# Altium schematic sheet 4_MICROCONTROLADOR.SchDoc
size Tabloid; SheetNumber: 4; SheetTotal: 5; SPICEModelCacheCXJGCLTJ: <root> / <DocumentId>CXJGCLTJ</DocumentId> / <CacheFrame Number="0"> / <Model Name="0805_885012207053_4.7uf" Kind="CKT"> / <Text>******* / .subckt 0805_885012207053_4.7uF 1 2 / Rser 1 3 0.0105 / Lser 2 4 0.0000000007 / C1 3 4 0.0000047 / Rpar 3 4 10000000 / .ends 0805_885012207053_4.7uF</Text> / </Model> / <Model Name="0603_885012206046_100nf" Kind="CKT"> / <Text>******* / .subckt 0603_885012206046_100nF 1 2 / Rser 1 3 0.0189313024822 / Lser 2 4 4.50736859E-10 / C1 3 4 0.0000001 / Rpar 3 4 5000000000 / .ends 0603_885012206046_100nF</Text> / </Model> / <Model Name="0805_885012207026_10uf" Kind="CKT"> / <Text>******* / .subckt 0805_885012207026_10uF 1 2 / Rser 1 3 0.00369416302331 / Lser 2 4 5.01488494E-10 / C1 3 4 0.00001 / Rpar 3 4 5000000 / .ends 0805_885012207026_10uF</Text> / </Model> / <Model Name="0603_74279266_1000ohm" Kind="CKT"> / <Text>******* / .subckt 0603_74279266_1000ohm 1 2 / Rp 1 2 1290 / Cp 1 2 0.604p / Rs 1 N3 0.6 / L1 N3 2 2.393u / .ends 0603_74279266_1000ohm</Text> / </Model> / <Model Name="0603_150060vs75000" Kind="CKT"> / <Text>****** / .subckt 0603_150060VS75000  1  2 / D1 1 2 SMCW / .MODEL SMCW D / + IS=10.010E-21 / + N=1.9077 / + RS=1.0000E-6 / + IKF=32.936E-3 / + CJO=1.0000E-12 / + M=.3333 / + VJ=.75 / + BV=5 / + IBV=10.00E-6 / + TT=5.0000E-9 / .ends</Text> / </Model> / <Model Name="0603_885012106004_2.2uf" Kind="CKT"> / <Text>******* / .subckt 0603_885012106004_2.2uF 1 2 / Rser 1 3 0.00652337052819 / Lser 2 4 4.58001637E-10 / C1 3 4 0.0000022 / Rpar 3 4 50000000 / .ends 0603_885012106004_2.2uF</Text> / </Model> / </CacheFrame> / </root>
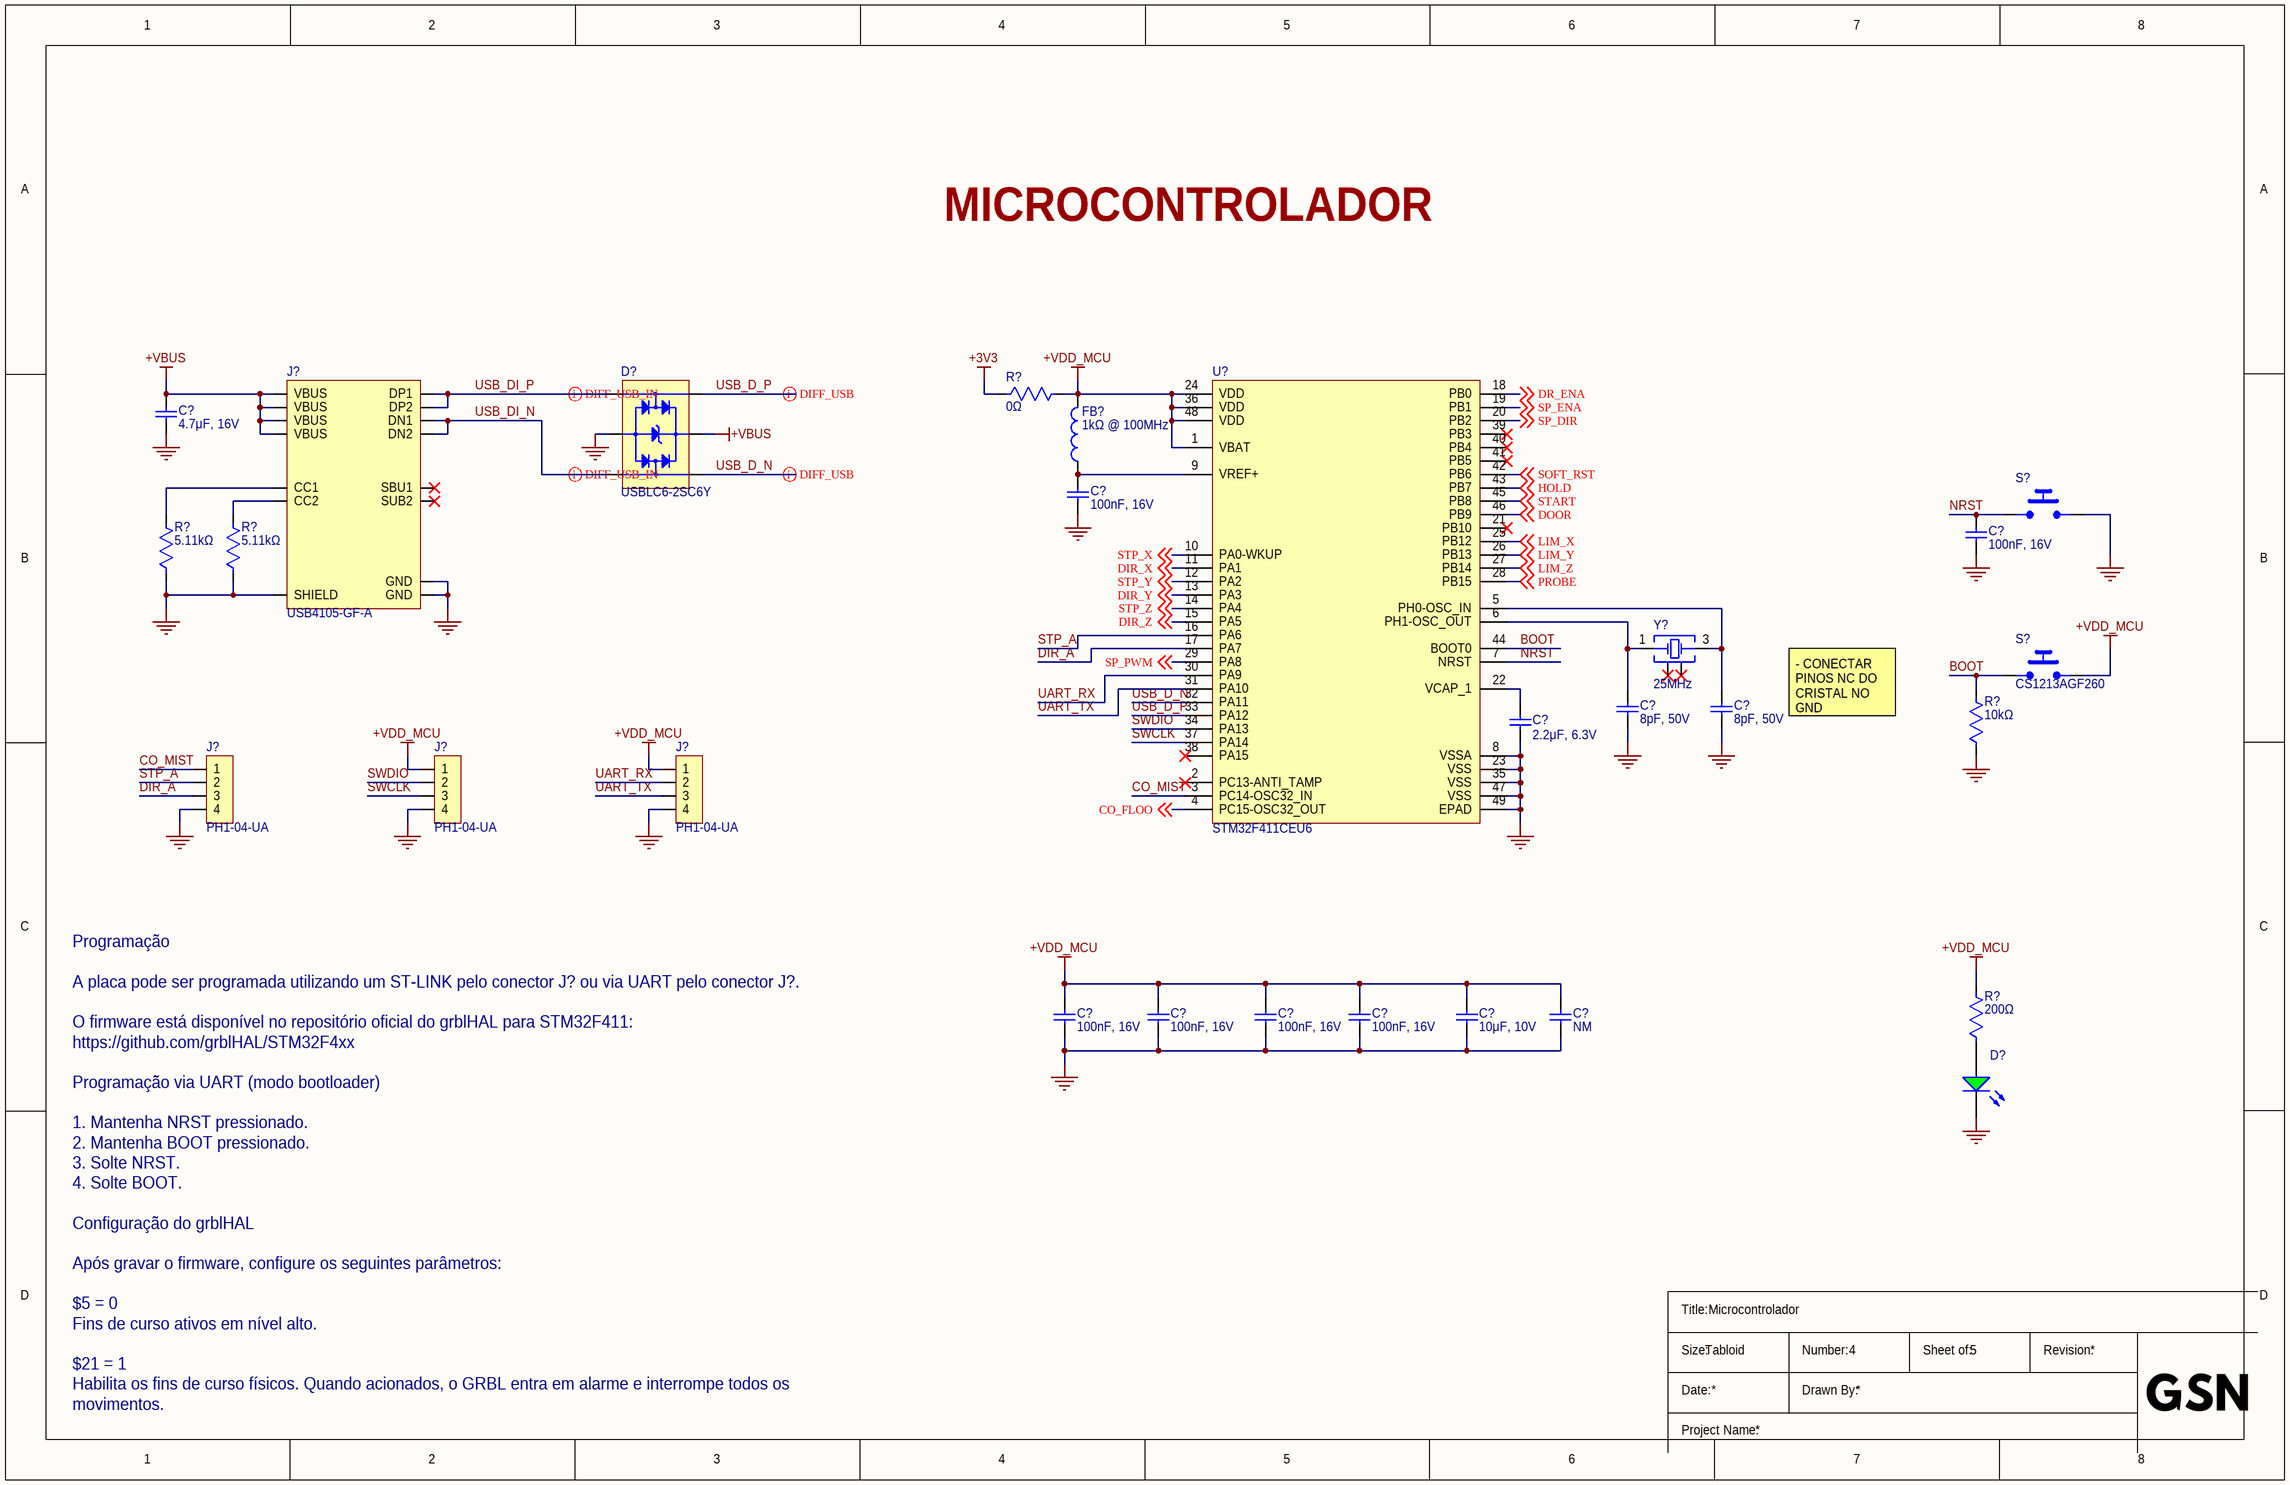
[diagram p0: 4_MICROCONTROLADOR.SchDoc]

## Parts
(Parts that share a designator on the sheet are numbered #1, #2 ... from top to bottom, then left to right.)
C?#1  4.7μF, 16V  [WCAP-CSGP_0805_L2W1.25H1.25]
C?#2  100nF, 16V  [WCAP-CSGP_0603_L1.6W0.8H0.8_Reflow]
C?#3  100nF, 16V  [WCAP-CSGP_0603_L1.6W0.8H0.8_Reflow]
C?#4  8pF, 50V  [CAP-CER-0603]
C?#5  8pF, 50V  [CAP-CER-0603]
C?#6  2.2μF, 6.3V  [WCAP-CSGP_0603_L1.6W0.8H0.8_Reflow]
C?#7  100nF, 16V  [WCAP-CSGP_0603_L1.6W0.8H0.8_Reflow]
C?#8  100nF, 16V  [WCAP-CSGP_0603_L1.6W0.8H0.8_Reflow]
C?#9  100nF, 16V  [WCAP-CSGP_0603_L1.6W0.8H0.8_Reflow]
C?#10  100nF, 16V  [WCAP-CSGP_0603_L1.6W0.8H0.8_Reflow]
C?#11  10μF, 10V  [WCAP-CSGP_0805_L2W1.25H1.25]
C?#12  NM  [WCAP-CSGP_0805_L2W1.25H1.25]
D?#1  USBLC6-2SC6Y  [SOT-23-6]
D?#2  Bright Green, 2V, 140°  [WL-SMCW_0603_150060xx75000]  (value not drawn)
FB?  1kΩ @ 100MHz  [WE-CBF_0603_L1.6W0.8H0.8_HS_WB]
J?#1  USB4105-GF-A  [USB4105-GF-A]
J?#2  PH1-04-UA  [CON_HDR_MAL_VERT_4P_2P54_PITCH]
J?#3  PH1-04-UA  [CON_HDR_MAL_VERT_4P_2P54_PITCH]
J?#4  PH1-04-UA  [CON_HDR_MAL_VERT_4P_2P54_PITCH]
R?#1  0Ω  [0805-REFLOW]
R?#2  5.11kΩ  [0603-REFLOW]
R?#3  5.11kΩ  [0603-REFLOW]
R?#4  10kΩ  [0603-REFLOW]
R?#5  200Ω  [0603-REFLOW]
S?#1  CS1213AGF260  [TACTILE_SWITCH_SMD_3P9MM_2P9MM]  (value not drawn)
S?#2  CS1213AGF260  [TACTILE_SWITCH_SMD_3P9MM_2P9MM]
U?  STM32F411CEU6  [UFQFN-48-7X7_EXPOSED_PAD]
Y?  25MHz  [WE-XTAL_CFPX-180]

## Nets
+3V3: R?#1.1
+VBUS: C?#1.2 D?#1.5(VBUS) J?#1.A4(VBUS) J?#1.A9(VBUS) J?#1.B4(VBUS) J?#1.B9(VBUS)
+VDD_MCU: C?#7.2 C?#8.2 C?#9.2 C?#10.2 C?#11.2 C?#12.2 FB?.2 J?#3.1 J?#4.1 R?#1.2 R?#5.2 S?#2.2 U?.1(VBAT) U?.24(VDD) U?.36(VDD) U?.48(VDD)
GND: C?#1.1 C?#2.1 C?#3.1 C?#4.1 C?#5.1 C?#6.1 C?#7.1 C?#8.1 C?#9.1 C?#10.1 C?#11.1 C?#12.1 D?#1.2(GND) D?#2.1(K) J?#1.A1_B12(GND) J?#1.B1_A12(GND) J?#1.SH(SHIELD) J?#2.4 J?#3.4 J?#4.4 R?#2.1 R?#3.1 R?#4.1 S?#1.2 U?.8(VSSA) U?.23(VSS) U?.35(VSS) U?.47(VSS) U?.49(EPAD)
BOOT: R?#4.2 S?#2.1 U?.44(BOOT0)
CO_FLOO: U?.4(PC15-OSC32_OUT) ; off-sheet CO_FLOO
CO_MIST: J?#2.1 U?.3(PC14-OSC32_IN)
DIR_A: J?#2.3 U?.17(PA7)
DIR_X: U?.11(PA1) ; off-sheet DIR_X
DIR_Y: U?.13(PA3) ; off-sheet DIR_Y
DIR_Z: U?.15(PA5) ; off-sheet DIR_Z
DOOR: U?.46(PB9) ; off-sheet DOOR
DR_ENA: U?.18(PB0) ; off-sheet DR_ENA
HOLD: U?.43(PB7) ; off-sheet HOLD
LIM_X: U?.25(PB12) ; off-sheet LIM_X
LIM_Y: U?.26(PB13) ; off-sheet LIM_Y
LIM_Z: U?.27(PB14) ; off-sheet LIM_Z
NRST: C?#3.2 S?#1.1 U?.7(NRST)
PROBE: U?.28(PB15) ; off-sheet PROBE
SOFT_RST: U?.42(PB6) ; off-sheet SOFT_RST
SP_DIR: U?.20(PB2) ; off-sheet SP_DIR
SP_ENA: U?.19(PB1) ; off-sheet SP_ENA
SP_PWM: U?.29(PA8) ; off-sheet SP_PWM
START: U?.45(PB8) ; off-sheet START
STP_A: J?#2.2 U?.16(PA6)
STP_X: U?.10(PA0-WKUP) ; off-sheet STP_X
STP_Y: U?.12(PA2) ; off-sheet STP_Y
STP_Z: U?.14(PA4) ; off-sheet STP_Z
SWCLK: J?#3.3 U?.37(PA14)
SWDIO: J?#3.2 U?.34(PA13)
UART_RX: J?#4.2 U?.30(PA9)
UART_TX: J?#4.3 U?.31(PA10)
USB_D_N: D?#1.4(IO2) U?.32(PA11)
USB_D_P: D?#1.6(IO1) U?.33(PA12)
USB_DI_N: D?#1.3(IO2) J?#1.A7(DN1) J?#1.B7(DN2)
USB_DI_P: D?#1.1(IO1) J?#1.A6(DP1) J?#1.B6(DP2)
NetC?#2_2: C?#2.2 FB?.1 U?.9(VREF+)
NetC?#4_2: C?#4.2 U?.6(PH1-OSC_OUT) Y?.1(Crystal)
NetC?#5_2: C?#5.2 U?.5(PH0-OSC_IN) Y?.3(Crystal)
NetC?#6_2: C?#6.2 U?.22(VCAP_1)
NetD?#2_2: D?#2.2(A) R?#5.1
NetJ?#1_A5: J?#1.A5(CC1) R?#2.2
NetJ?#1_B5: J?#1.B5(CC2) R?#3.2

Not connected (* = marked no-connect by the designer): J?#1 A8(SBU1)* B8(SUB2)*; U? 2(PC13-ANTI_TAMP)* 21(PB10)* 38(PA15)* 39(PB3)* 40(PB4)* 41(PB5)*; Y? 2(GND&Lid)* 4(GND&Lid)*

## Layout directives
differential pair; differential pair class USB: USB_D_N, USB_D_P, USB_DI_N, USB_DI_P

## Notes on the sheet
- MICROCONTROLADOR
- - CONECTAR PINOS NC DO CRISTAL NO GND
- Microcontrolador
- Programação
  A placa pode ser programada utilizando um ST-LINK pelo conector J? ou via UART pelo conector J?.
  O firmware está disponível no repositório oficial do grblHAL para STM32F411:
  https://github.com/grblHAL/STM32F4xx
  Programação via UART (modo bootloader)
  1. Mantenha NRST pressionado.
  2. Mantenha BOOT pressionado.
  3. Solte NRST.
  4. Solte BOOT.
  Configuração do grblHAL
  Após gravar o firmware, configure os seguintes parâmetros:
  $5 = 0
  Fins de curso ativos em nível alto.
  $21 = 1
  Habilita os fins de curso físicos. Quando acionados, o GRBL entra em alarme e interrompe todos os movimentos.
  $6 = 0
  Define o probe como ativo em nível alto.
- Title:
- Size:
- Tabloid
- Number:
- Sheet of:
- Revision:
- Date:
- Project Name:
- Drawn By:

## Library data of the parts
C?#1 = 885012207053: WCAP-CSGP Multilayer Ceramic Chip Capacitor, General Purpose, size 0805, 4.7μF, 16V; Manufacturer: Wurth Elektronik; Case/Size Code: 0805; Capacitance Tolerance: +/-10%; Ceramic Type: X7R; Dissipation Factor: 10%; Insulation Resistance: 0.02GΩ; Technical Reference: X7R0805475K016DFCT10000; Manufacturer Part Number: 885012207053; Category: Multilayer Ceramic Chip Capacitors; Match Code: WCAP-CSGP; ComponentLink1Description: Website Link; ComponentLink1URL: https://www.we-online.com/redexpert/article/885012207053?ad; ComponentLink2Description: Datasheet Link; ComponentLink2URL: https://www.we-online.com/redexpert/spec/885012207053?ad; Mount: Surface Mount; Min Operating Temperature: -55°C; Max Operating Temperature: 125°C; Packaging: Tape and Reel; Length: 2mm; Width: 1.25mm; Height: 1.25mm; Capacitance: 4.7μF; Rated Voltage (DC): 16V
C?#2 C?#3 C?#7-C?#10 = 885012206046: WCAP-CSGP Multilayer Ceramic Chip Capacitor, General Purpose, size 0603, 100nF, 16V; Manufacturer: Wurth Elektronik; Case/Size Code: 0603; Capacitance Tolerance: +/-10%; Ceramic Type: X7R; Dissipation Factor: 3.5%; Insulation Resistance: 5GΩ; Technical Reference: X7R0603104K016DFCT10000; Manufacturer Part Number: 885012206046; Category: Multilayer Ceramic Chip Capacitors; Match Code: WCAP-CSGP; ComponentLink1Description: Website Link; ComponentLink1URL: https://www.we-online.com/redexpert/article/885012206046?ad; ComponentLink2Description: Datasheet Link; ComponentLink2URL: https://www.we-online.com/redexpert/spec/885012206046?ad; Mount: Surface Mount; Min Operating Temperature: -55°C; Max Operating Temperature: 125°C; Packaging: Tape and Reel; Length: 1.6mm; Width: 0.8mm; Height: 0.8mm; Capacitance: 100nF; Rated Voltage (DC): 16V
C?#4 C?#5 = CC0603DRNPO9BN8R0: CAP CER 8PF 50V C0G/NPO 0603; Manufacturer: Yageo Group; Dielectric: C0G; Dielectric Material: Ceramic; Supplier: DigiKey; Supplier Part Number: 311-1057-1-ND; Manufacturer Part Number: CC0603DRNPO9BN8R0; RoHS: Compliant; Category: Ceramic Capacitors; Stock: 41634; Pricing: 1=0.1, 10=0.042, 50=0.0286, 100=0.0246, 500=0.01776, 1000=0.01568 (USD); Value: 8pF; Case/Package: 0603; Case Code (Imperial): 0603; Case Code (Metric): 1608; China RoHS: Compliant; Composition: Ceramic; Depth: 800µm; Halogen Free: Halogen Free; Height: 800µm; Lead Free: Lead Free; Length: 1.6mm; Lifecycle Status: Production; Max Operating Temperature: 125°C; Min Operating Temperature: -55°C; Mounting Technology: Surface Mount; Number of Terminals: 2; Packaging: Digi-Reel®; REACH SVHC: Yes; Schedule B: 8532240020, 8532240020|8532240020, 8532240020|8532240020|8532240020, 8532240020|8532240020|8532240020|8532240020; Termination: SMD/SMT; Thickness: 889µm; Voltage Rating: 50V; Voltage Rating (DC): 50V; Width: 800µm; ComponentLink1URL: https://datasheet.octopart.com:443/CC0603DRNPO9BN8R0-Yageo-datasheet-78855684.pdf?src-supplier=IHS; ComponentLink1Description: https://datasheet.octopart.com:443/CC0603DRNPO9BN8R0-Yageo-datasheet-78855684.pdf?src-supplier=IHS; ComponentLink2URL: https://datasheet.octopart.com:443/CC0603DRNPO9BN8R0-Yageo-datasheet-182029532.pdf?src-supplier=Farnell; ComponentLink2Description: https://datasheet.octopart.com:443/CC0603DRNPO9BN8R0-Yageo-datasheet-182029532.pdf?src-supplier=Farnell; ComponentLink3URL: https://datasheet.octopart.com:443/CC0603DRNPO9BN8R0-Yageo-datasheet-182029531.pdf?src-supplier=Farnell; ComponentLink3Description: https://datasheet.octopart.com:443/CC0603DRNPO9BN8R0-Yageo-datasheet-182029531.pdf?src-supplier=Farnell; ComponentLink4URL: https://datasheet.octopart.com:443/CC0603DRNPO9BN8R0-Yageo-datasheet-151948684.pdf?src-supplier=element14+APAC; ComponentLink4Description: https://datasheet.octopart.com:443/CC0603DRNPO9BN8R0-Yageo-datasheet-151948684.pdf?src-supplier=element14+APAC; ComponentLink5URL: https://datasheet.octopart.com:443/CC0603DRNPO9BN8R0-Yageo-datasheet-137875056.pdf?src-supplier=Future+Electronics; ComponentLink5Description: https://datasheet.octopart.com:443/CC0603DRNPO9BN8R0-Yageo-datasheet-137875056.pdf?src-supplier=Future+Electronics; ComponentLink6URL: https://datasheet.octopart.com:443/CC0603DRNPO9BN8R0-Yageo-datasheet-136957424.pdf?src-supplier=Future+Electronics; ComponentLink6Description: https://datasheet.octopart.com:443/CC0603DRNPO9BN8R0-Yageo-datasheet-136957424.pdf?src-supplier=Future+Electronics; ComponentLink7URL: https://datasheet.octopart.com:443/CC0603DRNPO9BN8R0-Yageo-datasheet-137700082.pdf?src-supplier=Future+Electronics; ComponentLink7Description: https://datasheet.octopart.com:443/CC0603DRNPO9BN8R0-Yageo-datasheet-137700082.pdf?src-supplier=Future+Electronics; ComponentLink8URL: https://datasheet.octopart.com:443/CC0603DRNPO9BN8R0-Yageo-datasheet-16730043.pdf?src-supplier=Future+Electronics; ComponentLink8Description: https://datasheet.octopart.com:443/CC0603DRNPO9BN8R0-Yageo-datasheet-16730043.pdf?src-supplier=Future+Electronics; ComponentLink9URL: https://datasheet.octopart.com:443/CC0603DRNPO9BN8R0-Yageo-datasheet-12589826.pdf?src-supplier=Future+Electronics; ComponentLink9Description: https://datasheet.octopart.com:443/CC0603DRNPO9BN8R0-Yageo-datasheet-12589826.pdf?src-supplier=Future+Electronics; ComponentLink10URL: https://datasheet.octopart.com:443/CC0603DRNPO9BN8R0-Yageo-datasheet-10406438.pdf?src-supplier=Future+Electronics; ComponentLink10Description: https://datasheet.octopart.com:443/CC0603DRNPO9BN8R0-Yageo-datasheet-10406438.pdf?src-supplier=Future+Electronics; ComponentLink11URL: https://datasheet.octopart.com:443/CC0603DRNPO9BN8R0-Yageo-datasheet-8817079.pdf?src-supplier=Future+Electronics; ComponentLink11Description: https://datasheet.octopart.com:443/CC0603DRNPO9BN8R0-Yageo-datasheet-8817079.pdf?src-supplier=Future+Electronics; ComponentLink12URL: https://datasheet.octopart.com:443/CC0603DRNPO9BN8R0-Yageo-datasheet-8324240.pdf?src-supplier=Future+Electronics; ComponentLink12Description: https://datasheet.octopart.com:443/CC0603DRNPO9BN8R0-Yageo-datasheet-8324240.pdf?src-supplier=Future+Electronics; ComponentLink13URL: https://datasheet.octopart.com:443/CC0603DRNPO9BN8R0-Yageo-datasheet-504625.pdf?src-supplier=Future+Electronics; ComponentLink13Description: https://datasheet.octopart.com:443/CC0603DRNPO9BN8R0-Yageo-datasheet-504625.pdf?src-supplier=Future+Electronics; ComponentLink14URL: https://datasheet.octopart.com:443/CC0603DRNPO9BN8R0-Yageo-datasheet-5321569.pdf?src-supplier=Future+Electronics; ComponentLink14Description: https://datasheet.octopart.com:443/CC0603DRNPO9BN8R0-Yageo-datasheet-5321569.pdf?src-supplier=Future+Electronics; ComponentLink15URL: http://sigma.octopart.com:80/conflict_mineral_statement/Yageo-company-3.pdf?src-supplier=Compliance+Statements; ComponentLink15Description: http://sigma.octopart.com:80/conflict_mineral_statement/Yageo-company-3.pdf?src-supplier=Compliance+Statements; ComponentLink16URL: http://sigma.octopart.com:80/rohs_statement/Yageo-company-2.pdf?src-supplier=Compliance+Statements; ComponentLink16Description: http://sigma.octopart.com:80/rohs_statement/Yageo-company-2.pdf?src-supplier=Compliance+Statements
C?#6 = 885012106004: WCAP-CSGP Multilayer Ceramic Chip Capacitor, General Purpose, size 0603, 2.2μF, 6.3V; Manufacturer: Wurth Elektronik; Case/Size Code: 0603; Capacitance Tolerance: +/-20%; Ceramic Type: X5R; Dissipation Factor: 10%; Insulation Resistance: 0.05GΩ; Technical Reference: X5R0603225M6R3DFCT10000; Manufacturer Part Number: 885012106004; Category: Multilayer Ceramic Chip Capacitors; Match Code: WCAP-CSGP; ComponentLink1Description: Website Link; ComponentLink1URL: https://www.we-online.com/redexpert/article/885012106004?ad; ComponentLink2Description: Datasheet Link; ComponentLink2URL: https://www.we-online.com/redexpert/spec/885012106004?ad; Mount: Surface Mount; Min Operating Temperature: -55°C; Max Operating Temperature: 85°C; Packaging: Tape and Reel; Length: 1.6mm; Width: 0.8mm; Height: 0.8mm; Capacitance: 2.2μF; Rated Voltage (DC): 6.3V
C?#11 C?#12 = 885012207026: WCAP-CSGP Multilayer Ceramic Chip Capacitor, General Purpose, size 0805, 10μF, 10V; Manufacturer: Wurth Elektronik; Case/Size Code: 0805; Capacitance Tolerance: +/-10%; Ceramic Type: X7R; Dissipation Factor: 10%; Insulation Resistance: 0.01GΩ; Technical Reference: X7R0805106K010DFCT10000; Manufacturer Part Number: 885012207026; Category: Multilayer Ceramic Chip Capacitors; Match Code: WCAP-CSGP; ComponentLink1Description: Website Link; ComponentLink1URL: https://www.we-online.com/redexpert/article/885012207026?ad; ComponentLink2Description: Datasheet Link; ComponentLink2URL: https://www.we-online.com/redexpert/spec/885012207026?ad; Mount: Surface Mount; Min Operating Temperature: -55°C; Max Operating Temperature: 125°C; Packaging: Tape and Reel; Length: 2mm; Width: 1.25mm; Height: 1.25mm; Capacitance: 10μF; Rated Voltage (DC): 10V
D?#1 = USBLC6-2SC6Y: TVS DIODE 5.25VWM 17VC SOT23-6; Manufacturer: STMicroelectronics; Breakdown Voltage: 6V; Value: 2.5pF; Clamping Voltage: 17V; Direction: Unidirectional; Element Configuration: Dual; ESD Protection: Yes; Forward Voltage: 860mV; Leakage Current: 150nA; Max Junction Temperature (Tj): 150°C; Number of Bidirectional Channels: 2; Number of Elements: 1; Operating Supply Voltage: 1.1V; Peak Pulse Current: 5A; Reverse Standoff Voltage: 5.25V; ESR: 330Ω; Test Current: 1mA; Supplier: DigiKey; Supplier Part Number: 497-11882-1-ND; Manufacturer Part Number: USBLC6-2SC6Y; RoHS: Compliant; Category: TVS Diodes; Stock: 64605; Pricing: 1=0.46, 10=0.298, 100=0.211, 500=0.164, 1000=0.144 (USD); Case/Package: SOT-23-6; China RoHS: Compliant; Depth: 1.75mm; Height: 1.45mm; Lead Free: Lead Free; Length: 3mm; Lifecycle Status: Production; Max Operating Temperature: 150°C; Max Reverse Leakage Current: 150nA; Min Breakdown Voltage: 6V; Min Operating Temperature: -40°C; Mounting Technology: Surface Mount; Number of Channels: 2; Pins: 6; Number of Terminals: 6; Packaging: Tape and Reel; Peak Reverse Current: 150nA; Polarity: Unidirectional; Power Line Protection: Yes; Radiation Hardening: No; REACH SVHC: Yes; Schedule B: 8536300000, 8536300000|8536300000|8536300000|8536300000|8536300000; Termination: SMD/SMT; Width: 1.75mm; ComponentLink1URL: https://datasheet.octopart.com:443/USBLC6-2SC6Y-STMicroelectronics-datasheet-12533815.pdf?src-supplier=ODG+(Origin+Data+Global); ComponentLink1Description: https://datasheet.octopart.com:443/USBLC6-2SC6Y-STMicroelectronics-datasheet-12533815.pdf?src-supplier=ODG+(Origin+Data+Global); ComponentLink2URL: https://datasheet.octopart.com:443/USBLC6-2SC6Y-STMicroelectronics-datasheet-13733956.pdf?src-supplier=STMicroelectronics; ComponentLink2Description: https://datasheet.octopart.com:443/USBLC6-2SC6Y-STMicroelectronics-datasheet-13733956.pdf?src-supplier=STMicroelectronics; ComponentLink3URL: https://datasheet.octopart.com:443/USBLC6-2SC6Y-STMicroelectronics-datasheet-10412581.pdf?src-supplier=Factory+Futures; ComponentLink3Description: https://datasheet.octopart.com:443/USBLC6-2SC6Y-STMicroelectronics-datasheet-10412581.pdf?src-supplier=Factory+Futures; ComponentLink4URL: https://datasheet.octopart.com:443/USBLC6-2SC6Y-STMicroelectronics-datasheet-525477.pdf?src-supplier=Factory+Futures; ComponentLink4Description: https://datasheet.octopart.com:443/USBLC6-2SC6Y-STMicroelectronics-datasheet-525477.pdf?src-supplier=Factory+Futures
D?#2 = 150060VS75000: WL-SMCW Mono-color Chip LED Waterclear, SMT, size 0603, Bright Green, 2V, 140°; Manufacturer: Wurth Elektronik; Case/Size Code: 0603; Chip Technology: AlInGaP; Dominant Wavelength: 570nm; Luminous Intensity: 40mcd; Peak Wavelength: 572nm; Manufacturer Part Number: 150060VS75000; Category: Signal LEDs; Match Code: WL-SMCW; ComponentLink1Description: Website Link; ComponentLink1URL: https://www.we-online.com/redexpert/article/150060VS75000?ad; ComponentLink2Description: Datasheet Link; ComponentLink2URL: https://www.we-online.com/redexpert/spec/150060VS75000?ad; Mount: Surface Mount; Min Operating Temperature: -40°C; Max Operating Temperature: 85°C; Packaging: Tape and Reel; Length: 1.6mm; Width: 0.8mm; Height: 0.7mm; Emitting Color: Bright Green; Forward Voltage: 2V; Viewing Angle: 140°
FB? = 74279266: WE-CBF SMT EMI Suppression Ferrite Bead, size 0603, 1000Ω, 0.65A; Manufacturer: Wurth Elektronik; Case/Size Code: 0603; DC Resistance Max: 0.6Ω; Impedance Max: 1350Ω; Impedance Max Test Condition: 140MHz; Type: Wide Band; Manufacturer Part Number: 74279266; Category: Ferrites for PCB Assembly; Match Code: WE-CBF; ComponentLink1Description: Website Link; ComponentLink1URL: https://www.we-online.com/redexpert/article/74279266?ad; ComponentLink2Description: Datasheet Link; ComponentLink2URL: https://www.we-online.com/redexpert/spec/74279266?ad; Mount: Surface Mount; Min Operating Temperature: -55°C; Max Operating Temperature: 125°C; Packaging: Tape and Reel; Length: 1.6mm; Width: 0.8mm; Height: 0.8mm; Impedance @100MHz: 1000Ω; Rated Current: 0.65A
J?#1 = USB4105-GF-A: CONN RCP USB2.0 TYP C 16P SMD RA; Manufacturer: Global Connector Technology; Contact Resistance: 50mΩ; Current Rating: 6.25A; Dielectric Material: Liquid Crystal Polymer; Gender: Receptacle; Insulation Resistance: 100MΩ; Number of Contacts: 16; Number of Ports: 1; Voltage Rating: 20V; Supplier: DigiKey; Supplier Part Number: 2073-USB4105-GF-ACT-ND; Manufacturer Part Number: USB4105-GF-A; RoHS: Compliant; Category: USB Connectors; Stock: 6325; Pricing: 1=0.78, 10=0.658, 25=0.6172, 50=0.5876, 100=0.5595, 250=0.5244 (USD); China RoHS: Compliant; Contact Gender: Female; Contact Material: Gold, Nickel; Height: 3.46mm; Lifecycle Status: Production; Max Operating Temperature: 85°C; Min Operating Temperature: -40°C; Pins: 24; Number of Rows: 1; Orientation: Horizontal; REACH SVHC: Yes; Shell Finish: Nickel; Shell Material: Stainless Steel; Terminal Pitch: 500µm; USB Standard: USB 2.0; ComponentLink1URL: https://datasheet.octopart.com:443/USB4105-GF-A-GCT-datasheet-166929323.pdf?src-supplier=SOS+electronic; ComponentLink1Description: https://datasheet.octopart.com:443/USB4105-GF-A-GCT-datasheet-166929323.pdf?src-supplier=SOS+electronic; ComponentLink2URL: https://datasheet.octopart.com:443/USB4105-GF-A-GCT-datasheet-188935996.pdf?src-supplier=TME; ComponentLink2Description: https://datasheet.octopart.com:443/USB4105-GF-A-GCT-datasheet-188935996.pdf?src-supplier=TME; ComponentLink3URL: https://datasheet.octopart.com:443/USB4105-GF-A-GCT-datasheet-188869076.pdf?src-supplier=TME; ComponentLink3Description: https://datasheet.octopart.com:443/USB4105-GF-A-GCT-datasheet-188869076.pdf?src-supplier=TME; ComponentLink4URL: https://datasheet.octopart.com:443/USB4105-GF-A-GCT-datasheet-166927665.pdf?src-supplier=TME; ComponentLink4Description: https://datasheet.octopart.com:443/USB4105-GF-A-GCT-datasheet-166927665.pdf?src-supplier=TME
J?#2-J?#4 = PH1-04-UA: CONN HEADER VERT 4POS 2.54MM; Manufacturer: Adam Tech; Contact Resistance: 20mΩ; Current Rating: 3A; Insulation Resistance: 5GΩ; Number of Positions: 4; Supplier: DigiKey; Supplier Part Number: 2057-PH1-04-UA-ND; Manufacturer Part Number: PH1-04-UA; RoHS: Compliant; Category: Card Edge Connectors; Stock: 26184; Pricing: 1=0.1, 10=0.05, 100=0.0424, 500=0.03784, 1000=0.03602, 5000=0.03215, 10000=0.03061 (USD); Contact Gender: Male; Contact Material: Brass; Lead Free: Lead Free; Lifecycle Status: Production; Pins: 4; Number of Rows: 1; Pitch: 2.54mm; REACH SVHC: Yes; Terminal Pitch: 2.54mm; Termination: Through Hole; ComponentLink1URL: https://datasheet.octopart.com:443/PH1-04-UA-Adam-Tech-datasheet-21182886.pdf?src-supplier=IHS; ComponentLink1Description: https://datasheet.octopart.com:443/PH1-04-UA-Adam-Tech-datasheet-21182886.pdf?src-supplier=IHS; ComponentLink2URL: https://datasheet.octopart.com:443/PH1-04-UA-Adam-Tech-datasheet-12339966.pdf?src-supplier=Future+Electronics; ComponentLink2Description: https://datasheet.octopart.com:443/PH1-04-UA-Adam-Tech-datasheet-12339966.pdf?src-supplier=Future+Electronics; ComponentLink3URL: https://datasheet.octopart.com:443/PH1-04-UA-Adam-Tech-datasheet-502038.pdf?src-supplier=Future+Electronics; ComponentLink3Description: https://datasheet.octopart.com:443/PH1-04-UA-Adam-Tech-datasheet-502038.pdf?src-supplier=Future+Electronics; ComponentLink4URL: https://datasheet.octopart.com:443/PH1-04-UA-Adam-Tech-datasheet-189096092.pdf?src-supplier=Master+Electronics; ComponentLink4Description: https://datasheet.octopart.com:443/PH1-04-UA-Adam-Tech-datasheet-189096092.pdf?src-supplier=Master+Electronics; ComponentLink5URL: http://sigma.octopart.com:80/reach_statement/Adam-Tech-company-23.pdf?src-supplier=Compliance+Statements; ComponentLink5Description: http://sigma.octopart.com:80/reach_statement/Adam-Tech-company-23.pdf?src-supplier=Compliance+Statements; ComponentLink6URL: http://sigma.octopart.com:80/rohs_statement/Adam-Tech-company-22.pdf?src-supplier=Compliance+Statements; ComponentLink6Description: http://sigma.octopart.com:80/rohs_statement/Adam-Tech-company-22.pdf?src-supplier=Compliance+Statements
R?#1 = RC0805FR-070RL: RES 0 OHM 1% 1/8W 0805; Manufacturer: Yageo Group; Power Dissipation: 125mW; Temperature Coefficient: 100ppm/°C; Voltage Rating: 150V; Supplier: DigiKey; Supplier Part Number: 311-0.0CRCT-ND; Manufacturer Part Number: RC0805FR-070RL; RoHS: Compliant; Category: Chip SMD Resistors; Stock: 748818; Pricing: 1=0.1, 10=0.017, 25=0.0144, 50=0.0124, 100=0.0109, 250=0.00916, 500=0.00808, 1000=0.00715 (USD); Case/Package: 0805; China RoHS: Non-Compliant; Composition: Thick Film; Contact Plating: Tin; Depth: 1.25mm; Height: 500µm; Lead Free: Lead Free; Length: 2mm; Lifecycle Status: Production; Max Operating Temperature: 155°C; Military Standard: Not; Min Operating Temperature: -55°C; Mounting Technology: Surface Mount; Number of Terminals: 2; Power Rating: 125mW; Radiation Hardening: No; REACH SVHC: Yes; Value: 0Ω; Tolerance: 1%; Width: 1.25mm; ComponentLink1URL: https://datasheet.octopart.com:443/RC0805FR-070RL-Yageo-datasheet-127823281.pdf?src-supplier=Upverter; ComponentLink1Description: https://datasheet.octopart.com:443/RC0805FR-070RL-Yageo-datasheet-127823281.pdf?src-supplier=Upverter; ComponentLink2URL: https://datasheet.octopart.com:443/RC0805FR-070RL-Yageo-datasheet-17879891.pdf?src-supplier=IHS; ComponentLink2Description: https://datasheet.octopart.com:443/RC0805FR-070RL-Yageo-datasheet-17879891.pdf?src-supplier=IHS; ComponentLink3URL: https://datasheet.octopart.com:443/RC0805FR-070RL-Yageo-datasheet-8330313.pdf?src-supplier=Burklin+Elektronik; ComponentLink3Description: https://datasheet.octopart.com:443/RC0805FR-070RL-Yageo-datasheet-8330313.pdf?src-supplier=Burklin+Elektronik; ComponentLink4URL: https://datasheet.octopart.com:443/RC0805FR-070RL-Yageo-datasheet-164759695.pdf?src-supplier=Future+Electronics; ComponentLink4Description: https://datasheet.octopart.com:443/RC0805FR-070RL-Yageo-datasheet-164759695.pdf?src-supplier=Future+Electronics; ComponentLink5URL: https://datasheet.octopart.com:443/RC0805FR-070RL-Yageo-datasheet-12592811.pdf?src-supplier=Future+Electronics; ComponentLink5Description: https://datasheet.octopart.com:443/RC0805FR-070RL-Yageo-datasheet-12592811.pdf?src-supplier=Future+Electronics; ComponentLink6URL: https://datasheet.octopart.com:443/RC0805FR-070RL-Yageo-datasheet-8324252.pdf?src-supplier=Future+Electronics; ComponentLink6Description: https://datasheet.octopart.com:443/RC0805FR-070RL-Yageo-datasheet-8324252.pdf?src-supplier=Future+Electronics; ComponentLink7URL: https://datasheet.octopart.com:443/RC0805FR-070RL-Yageo-datasheet-141265859.pdf?src-supplier=TME; ComponentLink7Description: https://datasheet.octopart.com:443/RC0805FR-070RL-Yageo-datasheet-141265859.pdf?src-supplier=TME; ComponentLink8URL: https://datasheet.octopart.com/RC0805FR-070RL-Yageo-datasheet-73766026.pdf; ComponentLink8Description: https://datasheet.octopart.com/RC0805FR-070RL-Yageo-datasheet-73766026.pdf; ComponentLink9URL: http://sigma.octopart.com:80/conflict_mineral_statement/Yageo-company-3.pdf?src-supplier=Compliance+Statements; ComponentLink9Description: http://sigma.octopart.com:80/conflict_mineral_statement/Yageo-company-3.pdf?src-supplier=Compliance+Statements; ComponentLink10URL: http://sigma.octopart.com:80/rohs_statement/Yageo-company-2.pdf?src-supplier=Compliance+Statements; ComponentLink10Description: http://sigma.octopart.com:80/rohs_statement/Yageo-company-2.pdf?src-supplier=Compliance+Statements
R?#2 R?#3 = RC0603FR-075K11L: RES 5.11K OHM 1% 1/10W 0603; Manufacturer: Yageo Group; Max Power Dissipation: 100mW; Temperature Coefficient: ±200ppm/°C; Voltage Rating (AC): 50V; Voltage Rating: 75V; Supplier Part Number: 311-5.11KHRCT-ND; Manufacturer Part Number: RC0603FR-075K11L; Value: 5.11kΩ; Case Code (Imperial): 0603; Case Code (Metric): 1608; Case/Package: 0603; Category: Chip SMD Resistors; China RoHS: Non-Compliant; Composition: Thick Film; Contact Plating: Tin; Depth: 800µm; Features: Moisture Resistant; Height: 450µm; Lead Free: Lead Free; Length: 1.6mm; Lifecycle Status: Production; Max Operating Temperature: 155°C; Military Standard: Not; Min Operating Temperature: -55°C; Mounting Technology: Surface Mount; Number of Terminals: 2; Number of Terminations: 2; Packaging: Tape & Reel; Power Dissipation: 100mW; Power Rating: 100mW; Radiation Hardening: No; REACH SVHC: Yes; RoHS: Compliant; Supplier: DigiKey; Termination: SMD/SMT; Tolerance: 1%; Component Link Description: https://www.yageogroup.com/content/datasheet/asset/file/PYU-RC_GROUP_51_ROHS_L; Component Link URL: https://www.yageogroup.com/content/datasheet/asset/file/PYU-RC_GROUP_51_ROHS_L; Datasheet: https://www.yageogroup.com/content/datasheet/asset/file/PYU-RC_GROUP_51_ROHS_L; Voltage Rating (DC): 50V; Weight: 2.012816mg; Width: 800µm; Working Voltage: 75V
R?#4 = RC0603FR-0710KL: RES 10K OHM 1% 1/10W 0603; Manufacturer: Yageo Group; Max Power Dissipation: 100mW; Temperature Coefficient: ±200ppm/°C; Voltage Rating (AC): 50V; Voltage Rating: 75V; Supplier Part Number: 311-10.0KHRCT-ND; Manufacturer Part Number: RC0603FR-0710KL; Value: 10kΩ; Case Code (Imperial): 0603; Case Code (Metric): 1608; Case/Package: 0603; Category: Chip SMD Resistors; China RoHS: Non-Compliant; Composition: Thick Film; Contact Plating: Tin; Depth: 800µm; Features: Moisture Resistant; Height: 450µm; Lead Free: Lead Free; Length: 1.6mm; Lifecycle Status: Production; Max Operating Temperature: 155°C; Military Standard: Not; Min Operating Temperature: -55°C; Mounting Technology: Surface Mount; Number of Terminals: 2; Number of Terminations: 2; Packaging: Tape & Reel; Power Dissipation: 100mW; Power Rating: 100mW; Radiation Hardening: No; REACH SVHC: Yes; RoHS: Compliant; Supplier: DigiKey; Termination: SMD/SMT; Tolerance: 1%; Component Link Description: https://www.yageogroup.com/content/datasheet/asset/file/PYU-RC_GROUP_51_ROHS_L; Component Link URL: https://www.yageogroup.com/content/datasheet/asset/file/PYU-RC_GROUP_51_ROHS_L; Datasheet: https://www.yageogroup.com/content/datasheet/asset/file/PYU-RC_GROUP_51_ROHS_L; Voltage Rating (DC): 50V; Weight: 2.012816mg; Width: 800µm; Working Voltage: 75V
R?#5 = RC0603FR-07200RL: RES 200 OHM 1% 1/10W 0603; Manufacturer: Yageo Group; Max Power Dissipation: 100mW; Temperature Coefficient: ±200ppm/°C; Voltage Rating (AC): 50V; Voltage Rating: 75V; Supplier Part Number: 311-200HRCT-ND; Manufacturer Part Number: RC0603FR-07200RL; Value: 200Ω; Case Code (Imperial): 0603; Case Code (Metric): 1608; Case/Package: 0603; Category: Chip SMD Resistors; China RoHS: Non-Compliant; Composition: Thick Film; Contact Plating: Tin; Depth: 800µm; Features: Moisture Resistant; Height: 450µm; Lead Free: Lead Free; Length: 1.6mm; Lifecycle Status: Production; Max Operating Temperature: 155°C; Military Standard: Not; Min Operating Temperature: -55°C; Mounting Technology: Surface Mount; Number of Terminals: 2; Number of Terminations: 2; Packaging: Tape & Reel; Power Dissipation: 100mW; Power Rating: 100mW; Radiation Hardening: No; REACH SVHC: Yes; RoHS: Compliant; Supplier: DigiKey; Termination: SMD/SMT; Tolerance: 1%; Component Link Description: https://www.yageogroup.com/content/datasheet/asset/file/PYU-RC_GROUP_51_ROHS_L; Component Link URL: https://www.yageogroup.com/content/datasheet/asset/file/PYU-RC_GROUP_51_ROHS_L; Datasheet: https://www.yageogroup.com/content/datasheet/asset/file/PYU-RC_GROUP_51_ROHS_L; Voltage Rating (DC): 50V; Weight: 2.012816mg; Width: 800µm; Working Voltage: 75V
S?#1 S?#2 = CS1213AGF260: SWITCH TACTILE SPST-NO 0.05A 50V; Manufacturer: CIT Relay & Switch; Supplier: DigiKey; Supplier Part Number: 2449-CS1213AGF260CT-ND; Manufacturer Part Number: CS1213AGF260; Category: Tactile Switches; Stock: 32750; Pricing: 1=0.39, 10=0.341, 25=0.3184, 100=0.285, 250=0.26408, 500=0.24922, 1000=0.23539 (USD)
U? = STM32F411CEU6: IC MCU 32BIT 512KB FLSH 48UFQFPN; Manufacturer: STMicroelectronics; ADC Channels (Resolution): 10-Ch 12-Bit; Core Architecture: ARM Cortex-M4; Data Bus Width: 32b; EEPROM Memory Size: 0B; Frequency: 100MHz; Interface: SDIO, USB; Clock Frequency: 26MHz; Max Power Dissipation: 625mW; Max Supply Current: 34.5mA; Max Supply Voltage: 3.6V; Memory Format: FLASH; Min Supply Voltage: 1.7V; Nominal Supply Current: 1.8µA; Number of A/D Converters: 1; Number of ADC Channels: 16; Number of Channels: 10; Number of I2C Channels: 3; Number of I/Os: 36; Number of SPI Channels: 5; Number of Timers/Counters: 2; Operating Supply Voltage: 3.3V; Oscillator Type: Internal; Peripherals: POR; RAM Size: 128kB; Watchdog Timer: Yes; Supplier: DigiKey; Supplier Part Number: 497-14907-ND; Manufacturer Part Number: STM32F411CEU6; RoHS: Compliant; Category: Microcontrollers; Stock: 3816; Pricing: 1=6.18, 10=4.745, 25=4.386, 100=3.991, 260=3.79569, 520=3.68344, 1040=3.59105, 2600=3.49353 (USD); Case/Package: UFQFPN; China RoHS: Compliant; Flash Memory Size: 512kB; Height - Seated (Max): 600µm; Lead Free: Lead Free; Length: 7mm; Lifecycle Status: Production; Max Operating Temperature: 85°C; Memory Size: 512kB; Min Operating Temperature: -40°C; Mounting Technology: Surface Mount; Number of Interrupts: 16; Pins: 48; Number of Programmable I/O: 36; Number of Terminals: 48; Number of USART Channels: 3; Packaging: Cut Tape; Radiation Hardening: No; REACH SVHC: Yes; Schedule B: 8542310000, 8542310000|8542310000|8542310000|8542310000|8542310000|8542310000|8542310000|8542310000|8542310000|8542310000|8542310000|8542310000|8542310000|8542310000|8542310000|8542310000|8542310000|8542310000|8542310000|8542310000|8542310000|8542310000|8542310000|85; Terminal Pitch: 500µm; Width: 7mm; ComponentLink1URL: https://datasheet.octopart.com:443/STM32F411CEU6-STMicroelectronics-datasheet-41919523.pdf?src-supplier=element14+APAC; ComponentLink1Description: https://datasheet.octopart.com:443/STM32F411CEU6-STMicroelectronics-datasheet-41919523.pdf?src-supplier=element14+APAC; ComponentLink2URL: https://datasheet.octopart.com:443/STM32F411CEU6-STMicroelectronics-datasheet-27102711.pdf?src-supplier=Upverter; ComponentLink2Description: https://datasheet.octopart.com:443/STM32F411CEU6-STMicroelectronics-datasheet-27102711.pdf?src-supplier=Upverter; ComponentLink3URL: https://datasheet.octopart.com:443/STM32F411CEU6-STMicroelectronics-datasheet-114750309.pdf?src-supplier=Newark; ComponentLink3Description: https://datasheet.octopart.com:443/STM32F411CEU6-STMicroelectronics-datasheet-114750309.pdf?src-supplier=Newark; ComponentLink4URL: https://datasheet.octopart.com:443/STM32F411CEU6-STMicroelectronics-datasheet-34219326.pdf?src-supplier=Newark; ComponentLink4Description: https://datasheet.octopart.com:443/STM32F411CEU6-STMicroelectronics-datasheet-34219326.pdf?src-supplier=Newark; ComponentLink5URL: https://datasheet.octopart.com:443/STM32F411CEU6-STMicroelectronics-datasheet-82511007.pdf?src-supplier=SHENGYU+ELECTRONICS; ComponentLink5Description: https://datasheet.octopart.com:443/STM32F411CEU6-STMicroelectronics-datasheet-82511007.pdf?src-supplier=SHENGYU+ELECTRONICS
Y? = 830072604: WE-XTAL Quartz Crystal, CFPX-180, 25MHz, +/-10ppm; Manufacturer: Wurth Elektronik; Frequency Stability: 20ppm; Load Capacitance: 8pF; Manufacturer Part Number: 830072604; Category: Crystals; Match Code: WE-XTAL; ComponentLink1Description: Website Link; ComponentLink1URL: https://www.we-online.com/redexpert/article/830072604?ad; ComponentLink2Description: Datasheet Link; ComponentLink2URL: https://www.we-online.com/redexpert/spec/830072604?ad; Mount: Surface Mount; Min Operating Temperature: -40°C; Max Operating Temperature: 85°C; Packaging: Tape and Reel; Case/Size Code: CFPX-180; Length: 3.2mm; Width: 2.5mm; Height: 0.8mm; Application: Processor, USB, 3G/4G/5G, Ethernet, Small Cell, PHY, PCI Express; Frequency: 25MHz; Frequency Tolerance: +/-10ppm